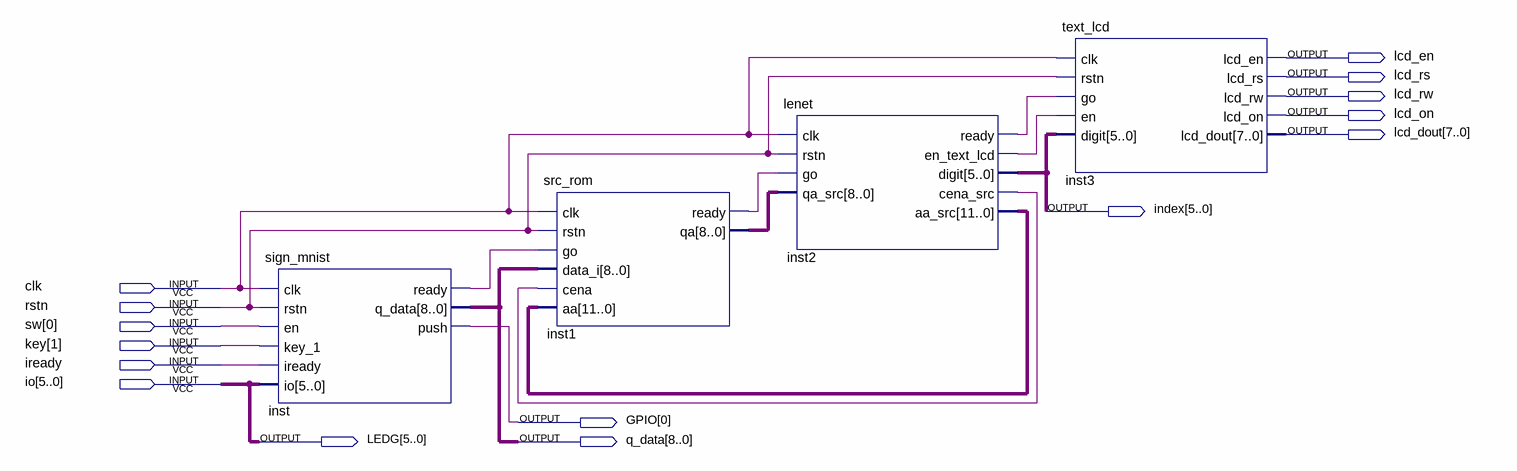
[diagram p0: schematic sheet]
// Quartus schematic fff.bdf as structural Verilog: 4 symbols, 15 pins
module fff (
  input  clk,
  input  rstn,
  input  [0:0] sw,
  input  [1:1] key,
  input  iready,
  input  [5:0] io,
  output lcd_en,
  output lcd_rs,
  output lcd_rw,
  output lcd_on,
  output [7:0] lcd_dout,
  output [5:0] index,
  output [0:0] GPIO,
  output [5:0] LEDG,
  output [8:0] q_data
);

  wire inst1_ready, inst2_cena_src, inst2_en_text_lcd, inst2_ready, inst_ready;
  wire [8:0] inst1_qa;
  wire [11:0] inst2_aa_src;

  sign_mnist inst (
    .clk(clk), .rstn(rstn), .en(sw[0]), .key_1(key[1]), .iready(iready), .io(io), .ready(inst_ready),
    .q_data(q_data), .push(GPIO[0]));
  src_rom inst1 (
    .clk(clk), .rstn(rstn), .go(inst_ready), .data_i(q_data), .cena(inst2_cena_src), .aa(inst2_aa_src),
    .ready(inst1_ready), .qa(inst1_qa));
  lenet inst2 (
    .clk(clk), .rstn(rstn), .go(inst1_ready), .qa_src(inst1_qa), .ready(inst2_ready),
    .en_text_lcd(inst2_en_text_lcd), .digit(index), .cena_src(inst2_cena_src), .aa_src(inst2_aa_src));
  text_lcd inst3 (
    .clk(clk), .rstn(rstn), .go(inst2_ready), .en(inst2_en_text_lcd), .digit(index), .lcd_en(lcd_en),
    .lcd_rs(lcd_rs), .lcd_rw(lcd_rw), .lcd_on(lcd_on), .lcd_dout(lcd_dout));

  assign LEDG = io;
endmodule
